# Altium schematic sheet 总图.SchDoc
size A3
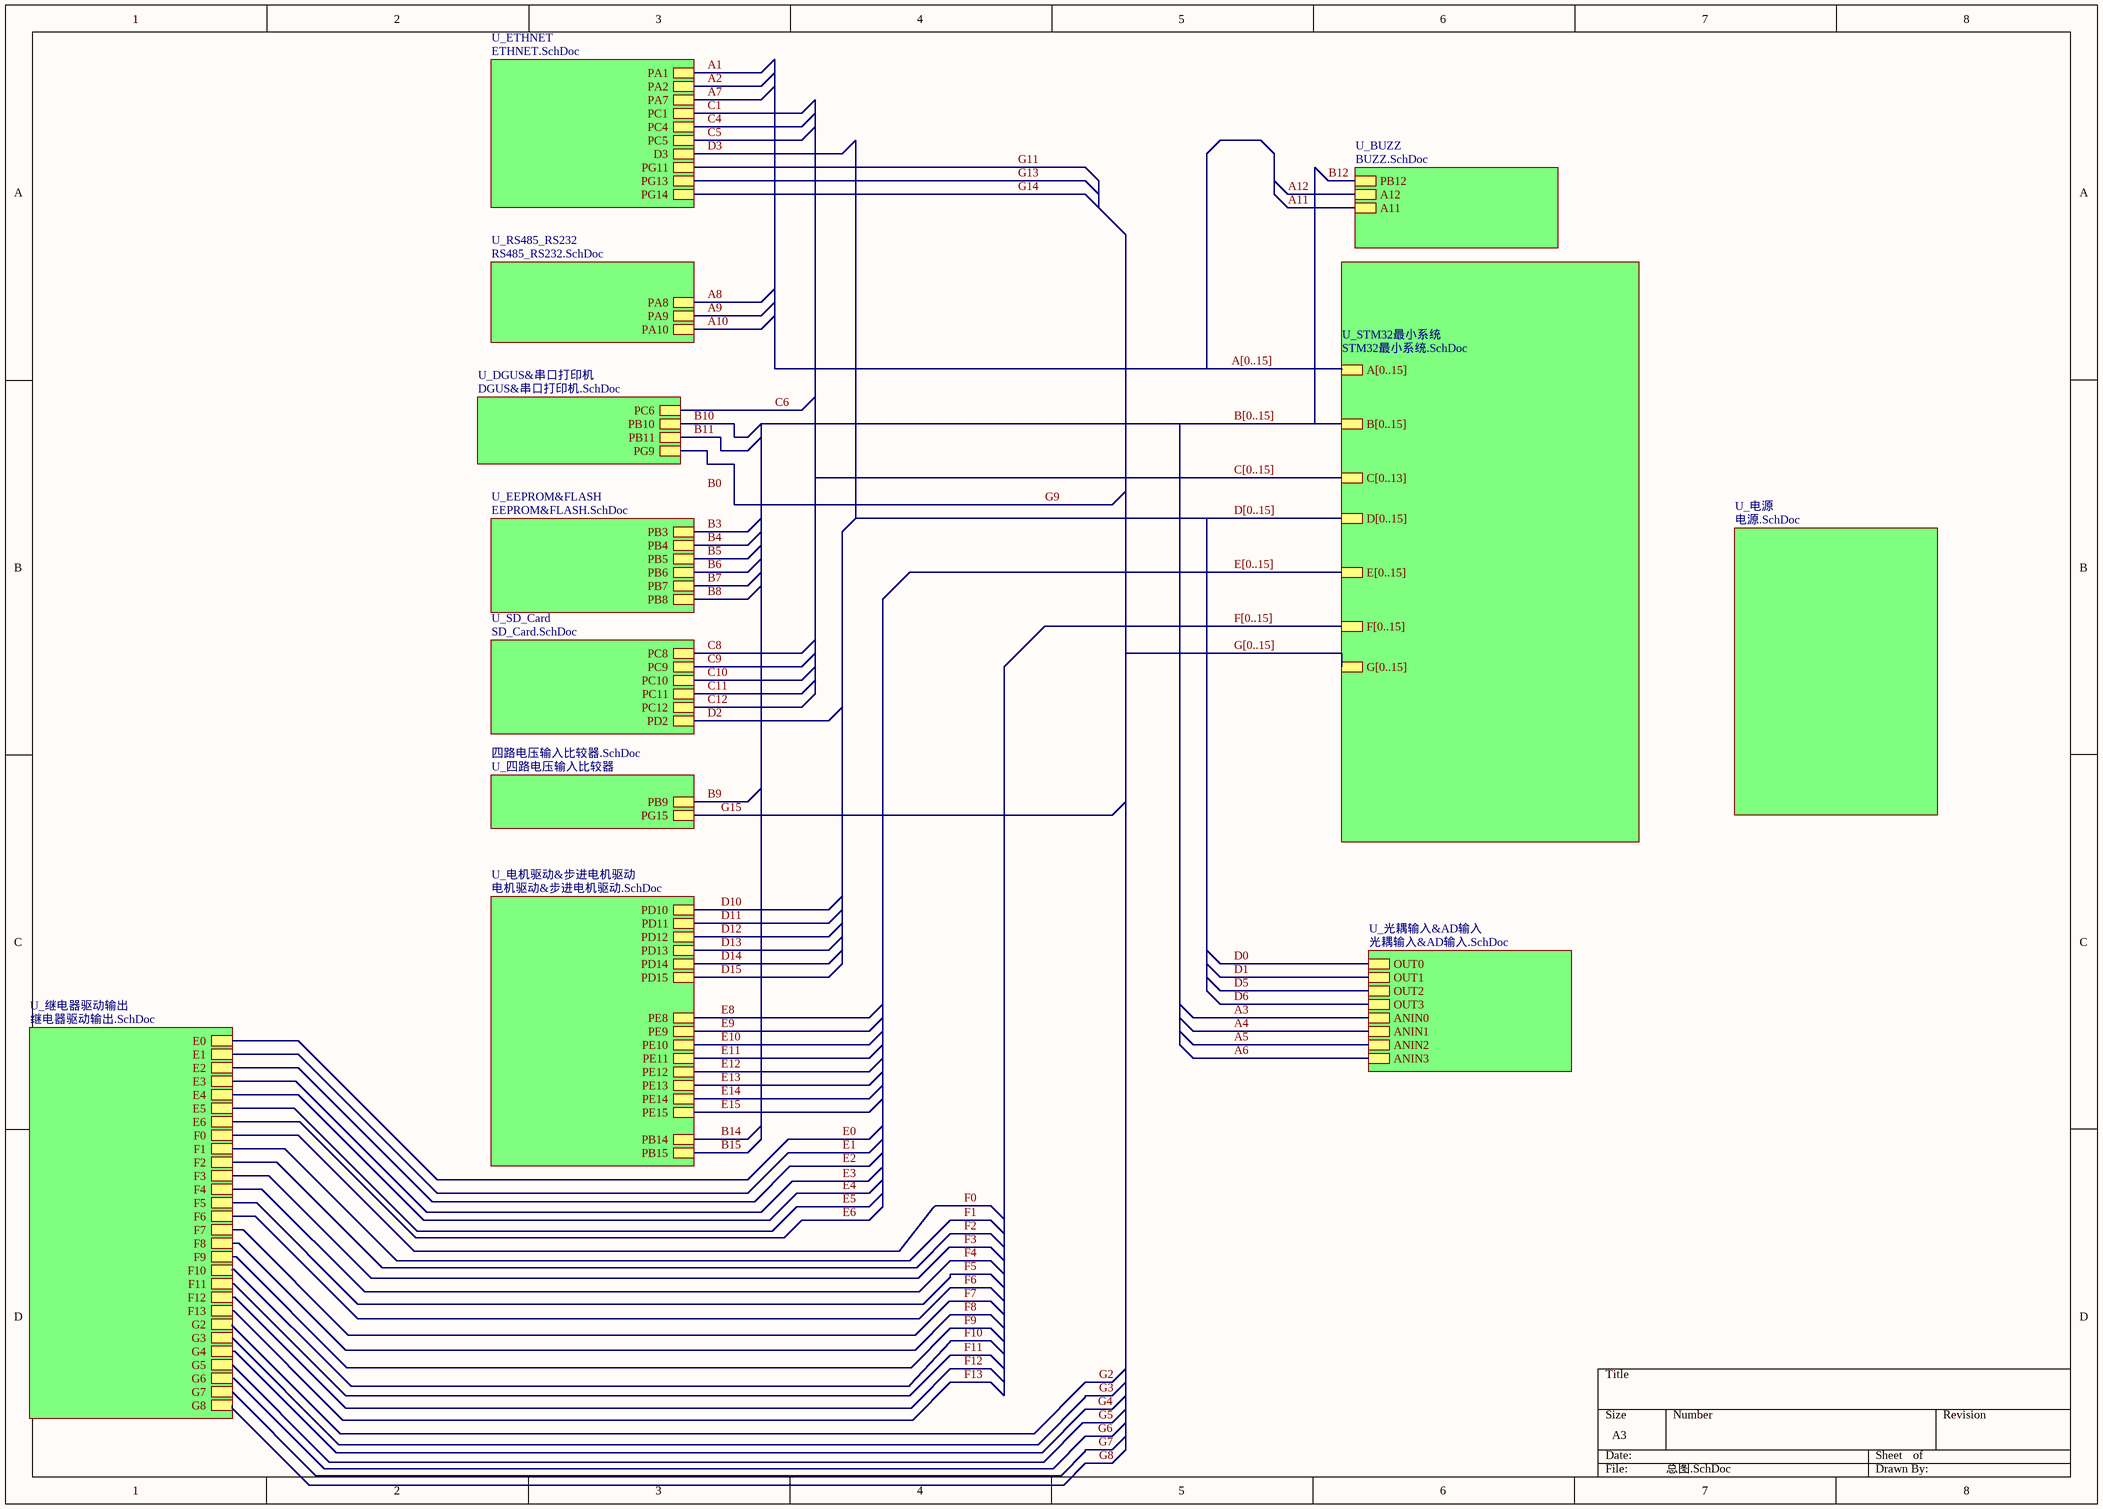
[diagram p0: 总图.SchDoc]

## Sub-sheets
U_BUZZ = BUZZ.SchDoc: PB12, A12, A11
U_DGUS&串口打印机 = DGUS&串口打印机.SchDoc: PG9, PB11, PC6, PB10
U_EEPROM&FLASH = EEPROM&FLASH.SchDoc: PB8, PB4, PB5, PB3, PB6, PB7
U_ETHNET = ETHNET.SchDoc: PA2, PC1, PG13, PG14, PG11, PC4, PC5, PA7, PA1, D3
U_RS485_RS232 = RS485_RS232.SchDoc: PA10, PA9, PA8
U_SD_Card = SD_Card.SchDoc: PC8, PC9, PC10, PC11, PC12, PD2
U_STM32最小系统 = STM32最小系统.SchDoc: A[0..15], B[0..15], C[0..13], D[0..15], E[0..15], F[0..15], G[0..15]
U_光耦输入&AD输入 = 光耦输入&AD输入.SchDoc: OUT0, OUT1, OUT2, OUT3, ANIN0, ANIN1, ANIN2, ANIN3
U_四路电压输入比较器 = 四路电压输入比较器.SchDoc: PG15, PB9
U_电机驱动&步进电机驱动 = 电机驱动&步进电机驱动.SchDoc: PE15, PE14, PE13, PE12, PE11, PE10, PE9, PE8, PD14, PD15, PB14, PB15, PD12, PD13, PD11, PD10
U_电源 = 电源.SchDoc: no entries
U_继电器驱动输出 = 继电器驱动输出.SchDoc: F0, F1, F2, F3, F4, F5, F6, E0, E1, E2, E3, E4, E5, E6, F7, F8, F9, F10, F11, F12, F13, G2, G3, G4, G5, G6, G7, G8

## Nets
A1: sheet U_ETHNET/PA1
A2: sheet U_ETHNET/PA2
A3: sheet U_光耦输入&AD输入/ANIN0
A4: sheet U_光耦输入&AD输入/ANIN1
A5: sheet U_光耦输入&AD输入/ANIN2
A6: sheet U_光耦输入&AD输入/ANIN3
A7: sheet U_ETHNET/PA7
A8: sheet U_RS485_RS232/PA8
A9: sheet U_RS485_RS232/PA9
A10: sheet U_RS485_RS232/PA10
A11: sheet U_BUZZ/A11
A12: sheet U_BUZZ/A12
B3: sheet U_EEPROM&FLASH/PB3
B4: sheet U_EEPROM&FLASH/PB4
B5: sheet U_EEPROM&FLASH/PB5
B6: sheet U_EEPROM&FLASH/PB6
B7: sheet U_EEPROM&FLASH/PB7
B8: sheet U_EEPROM&FLASH/PB8
B9: sheet U_四路电压输入比较器/PB9
B10: sheet U_DGUS&串口打印机/PB10
B11: sheet U_DGUS&串口打印机/PB11
B12: sheet U_BUZZ/PB12
B14: sheet U_电机驱动&步进电机驱动/PB14
B15: sheet U_电机驱动&步进电机驱动/PB15
C1: sheet U_ETHNET/PC1
C4: sheet U_ETHNET/PC4
C5: sheet U_ETHNET/PC5
C6: sheet U_DGUS&串口打印机/PC6
C8: sheet U_SD_Card/PC8
C9: sheet U_SD_Card/PC9
C10: sheet U_SD_Card/PC10
C11: sheet U_SD_Card/PC11
C12: sheet U_SD_Card/PC12
D0: sheet U_光耦输入&AD输入/OUT0
D1: sheet U_光耦输入&AD输入/OUT1
D2: sheet U_SD_Card/PD2
D3: sheet U_ETHNET/D3
D5: sheet U_光耦输入&AD输入/OUT2
D6: sheet U_光耦输入&AD输入/OUT3
D10: sheet U_电机驱动&步进电机驱动/PD10
D11: sheet U_电机驱动&步进电机驱动/PD11
D12: sheet U_电机驱动&步进电机驱动/PD12
D13: sheet U_电机驱动&步进电机驱动/PD13
D14: sheet U_电机驱动&步进电机驱动/PD14
D15: sheet U_电机驱动&步进电机驱动/PD15
E0: sheet U_继电器驱动输出/E0
E1: sheet U_继电器驱动输出/E1
E2: sheet U_继电器驱动输出/E2
E3: sheet U_继电器驱动输出/E3
E4: sheet U_继电器驱动输出/E4
E5: sheet U_继电器驱动输出/E5
E6: sheet U_继电器驱动输出/E6
E8: sheet U_电机驱动&步进电机驱动/PE8
E9: sheet U_电机驱动&步进电机驱动/PE9
E10: sheet U_电机驱动&步进电机驱动/PE10
E11: sheet U_电机驱动&步进电机驱动/PE11
E12: sheet U_电机驱动&步进电机驱动/PE12
E13: sheet U_电机驱动&步进电机驱动/PE13
E14: sheet U_电机驱动&步进电机驱动/PE14
E15: sheet U_电机驱动&步进电机驱动/PE15
F0: sheet U_继电器驱动输出/F0
F1: sheet U_继电器驱动输出/F1
F2: sheet U_继电器驱动输出/F2
F3: sheet U_继电器驱动输出/F3
F4: sheet U_继电器驱动输出/F4
F5: sheet U_继电器驱动输出/F5
F6: sheet U_继电器驱动输出/F6
F7: sheet U_继电器驱动输出/F7
F8: sheet U_继电器驱动输出/F8
F9: sheet U_继电器驱动输出/F9
F10: sheet U_继电器驱动输出/F10
F11: sheet U_继电器驱动输出/F11
F12: sheet U_继电器驱动输出/F12
F13: sheet U_继电器驱动输出/F13
G2: sheet U_继电器驱动输出/G2
G3: sheet U_继电器驱动输出/G3
G4: sheet U_继电器驱动输出/G4
G5: sheet U_继电器驱动输出/G5
G6: sheet U_继电器驱动输出/G6
G7: sheet U_继电器驱动输出/G7
G8: sheet U_继电器驱动输出/G8
G9: sheet U_DGUS&串口打印机/PG9
G11: sheet U_ETHNET/PG11
G13: sheet U_ETHNET/PG13
G14: sheet U_ETHNET/PG14
G15: sheet U_四路电压输入比较器/PG15

## Buses and harness runs
bus A[0..15] = sheet U_STM32最小系统/A[0..15]
bus B[0..15] = sheet U_STM32最小系统/B[0..15]
bus C[0..15] = sheet U_STM32最小系统/C[0..13]
bus D[0..15] = sheet U_STM32最小系统/D[0..15]
bus E[0..15] = sheet U_STM32最小系统/E[0..15]
bus F[0..15] = sheet U_STM32最小系统/F[0..15]
bus G[0..15] = sheet U_STM32最小系统/G[0..15]

## Notes on the sheet
- Labels drawn without touching a wire or pin: B0